# EasyEDA Pro project Motor_Sense_2025-12-15_V1.epro, schematic Schematic

## Sheets
1 core: Board Name: ESP_Motor_Talk; Create Date: 2025-12-16; Page Name: core; Project Name: ProDoc_LCSC ESP32S3R8N8 Dev Board V1.0.0_2025-12-15; Schematic Name: Schematic; Update Date: 2025-12-16; Company: 嘉立创EDA; Page Size: A4; Reviewed: 嘉立创EDA
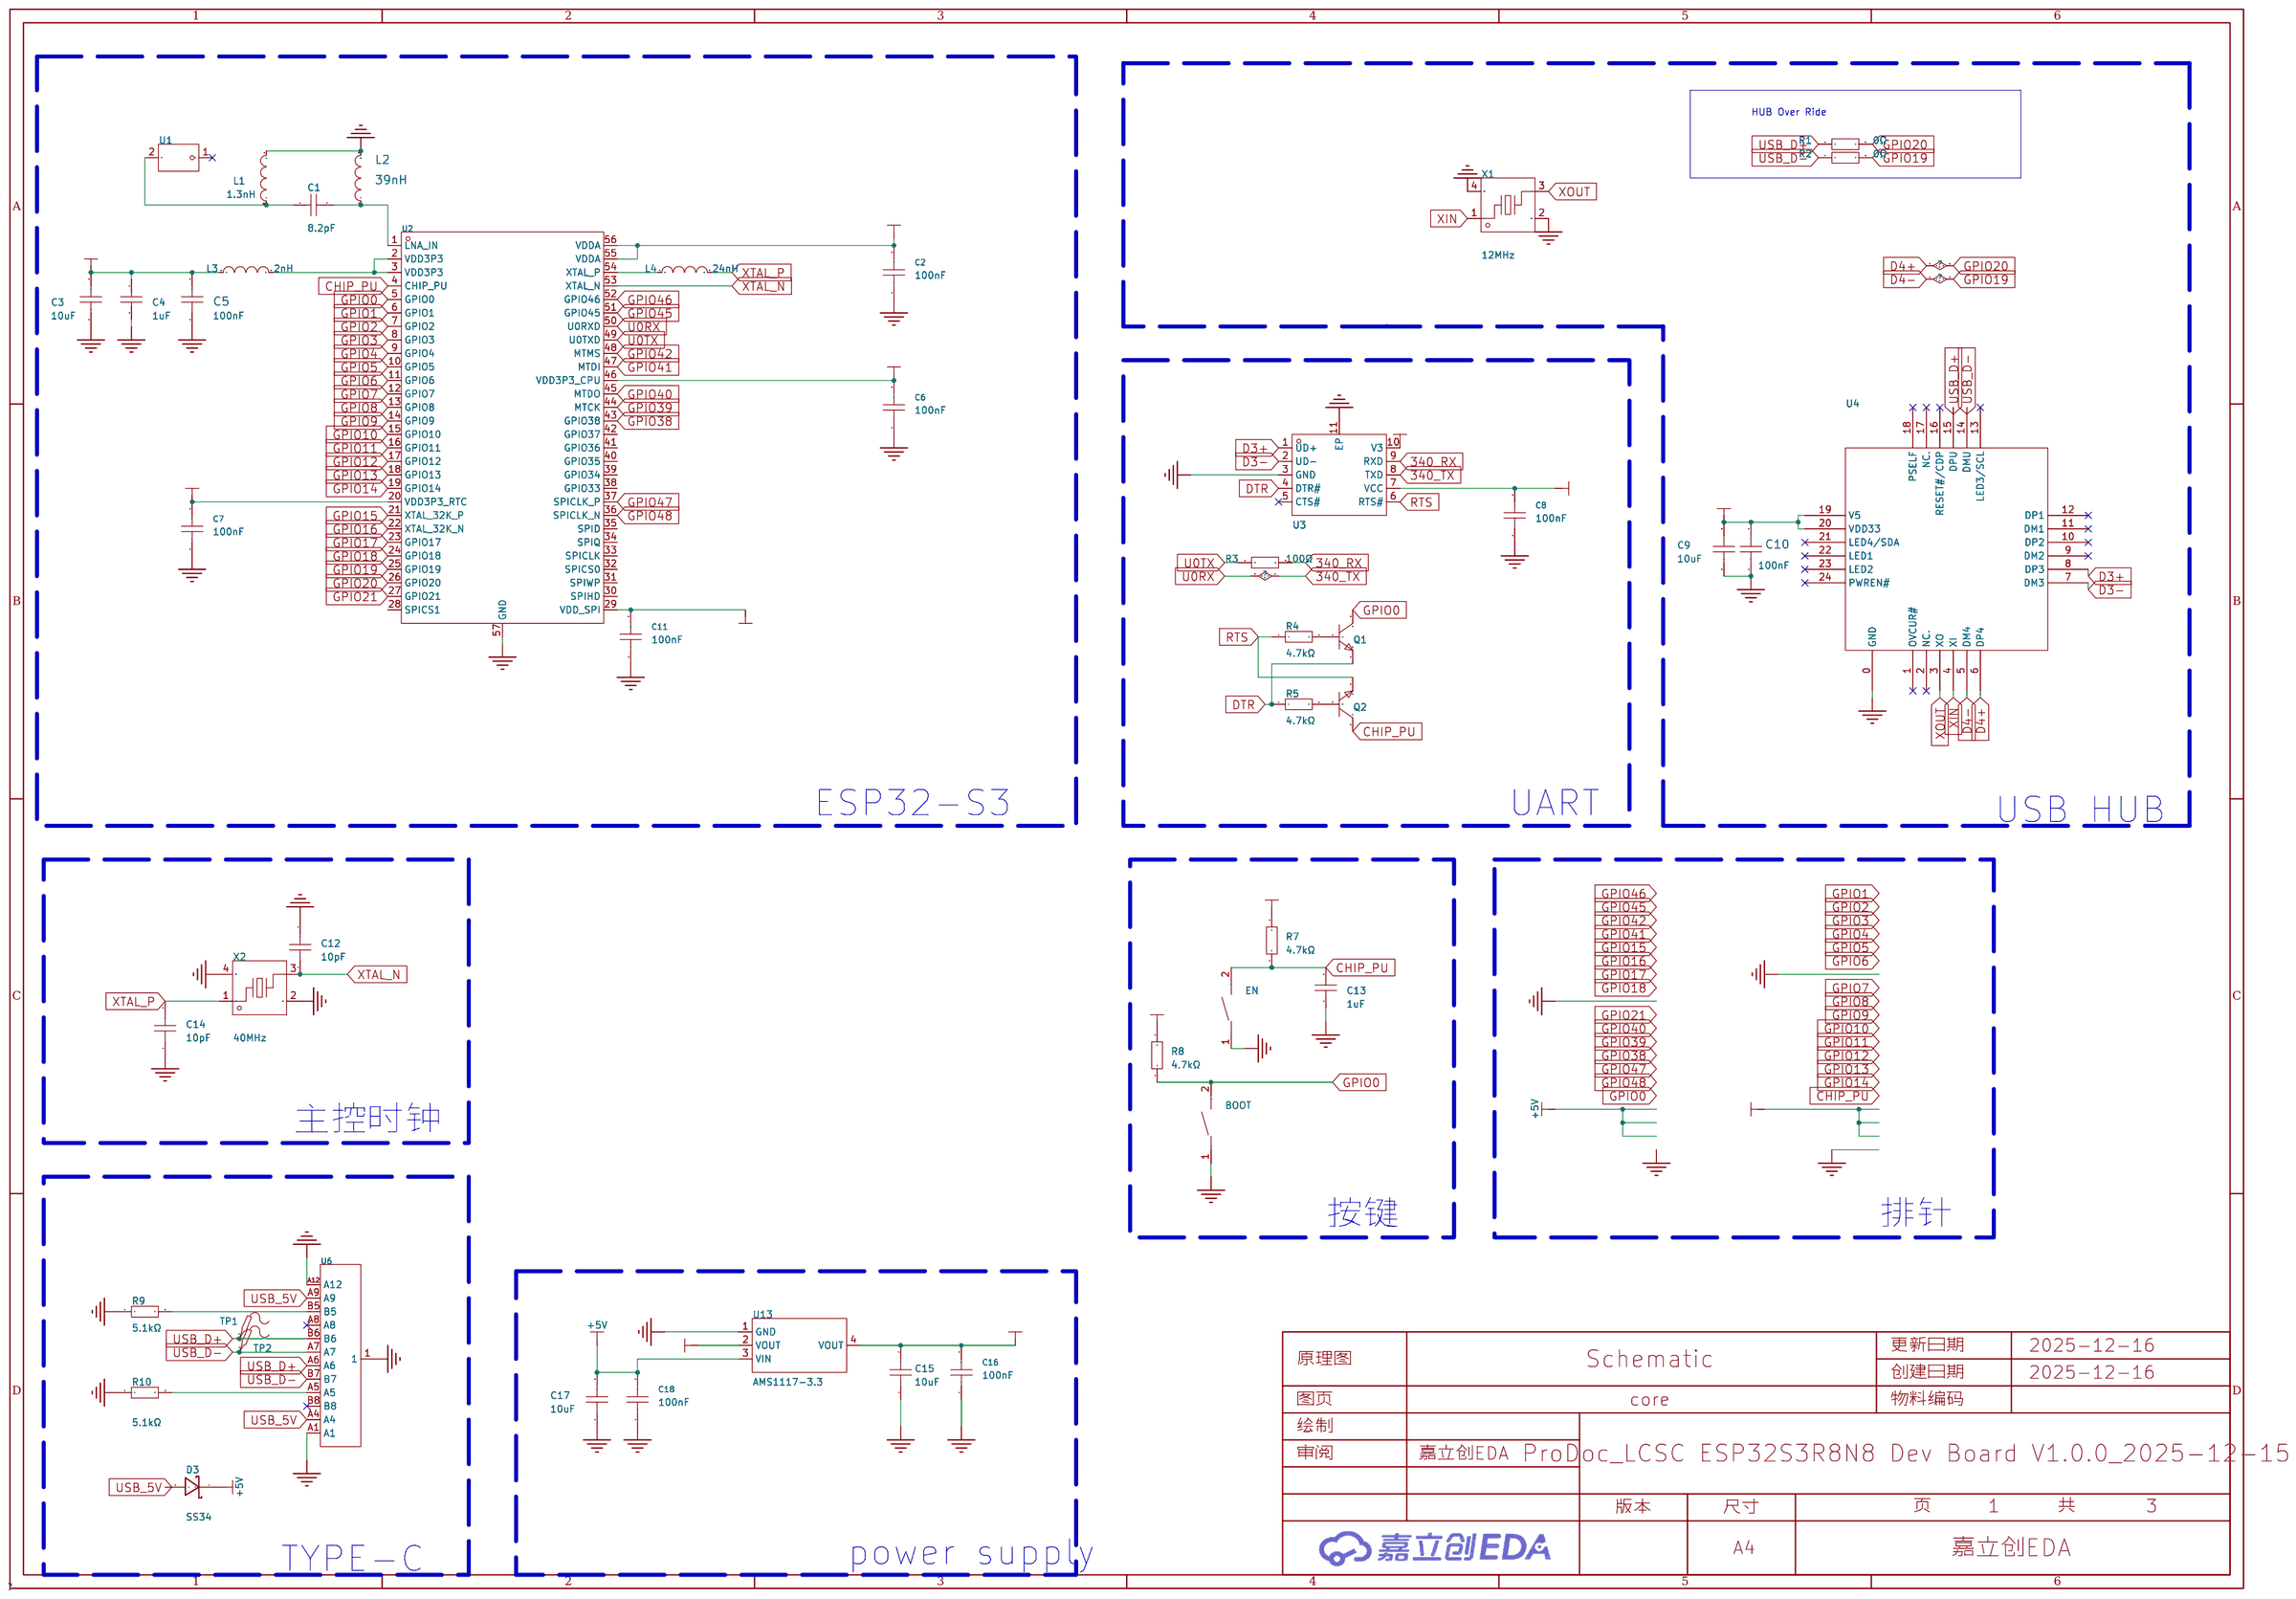
[diagram p0: core]
2 Power Supply: Page Name: Power Supply; Add into BOM: yes; Company: Your Company; Convert to PCB: yes; Date: 2025-09-11; Draw By: choosedews; REV: 1.0; Sheet: 1/1; spicePre: .
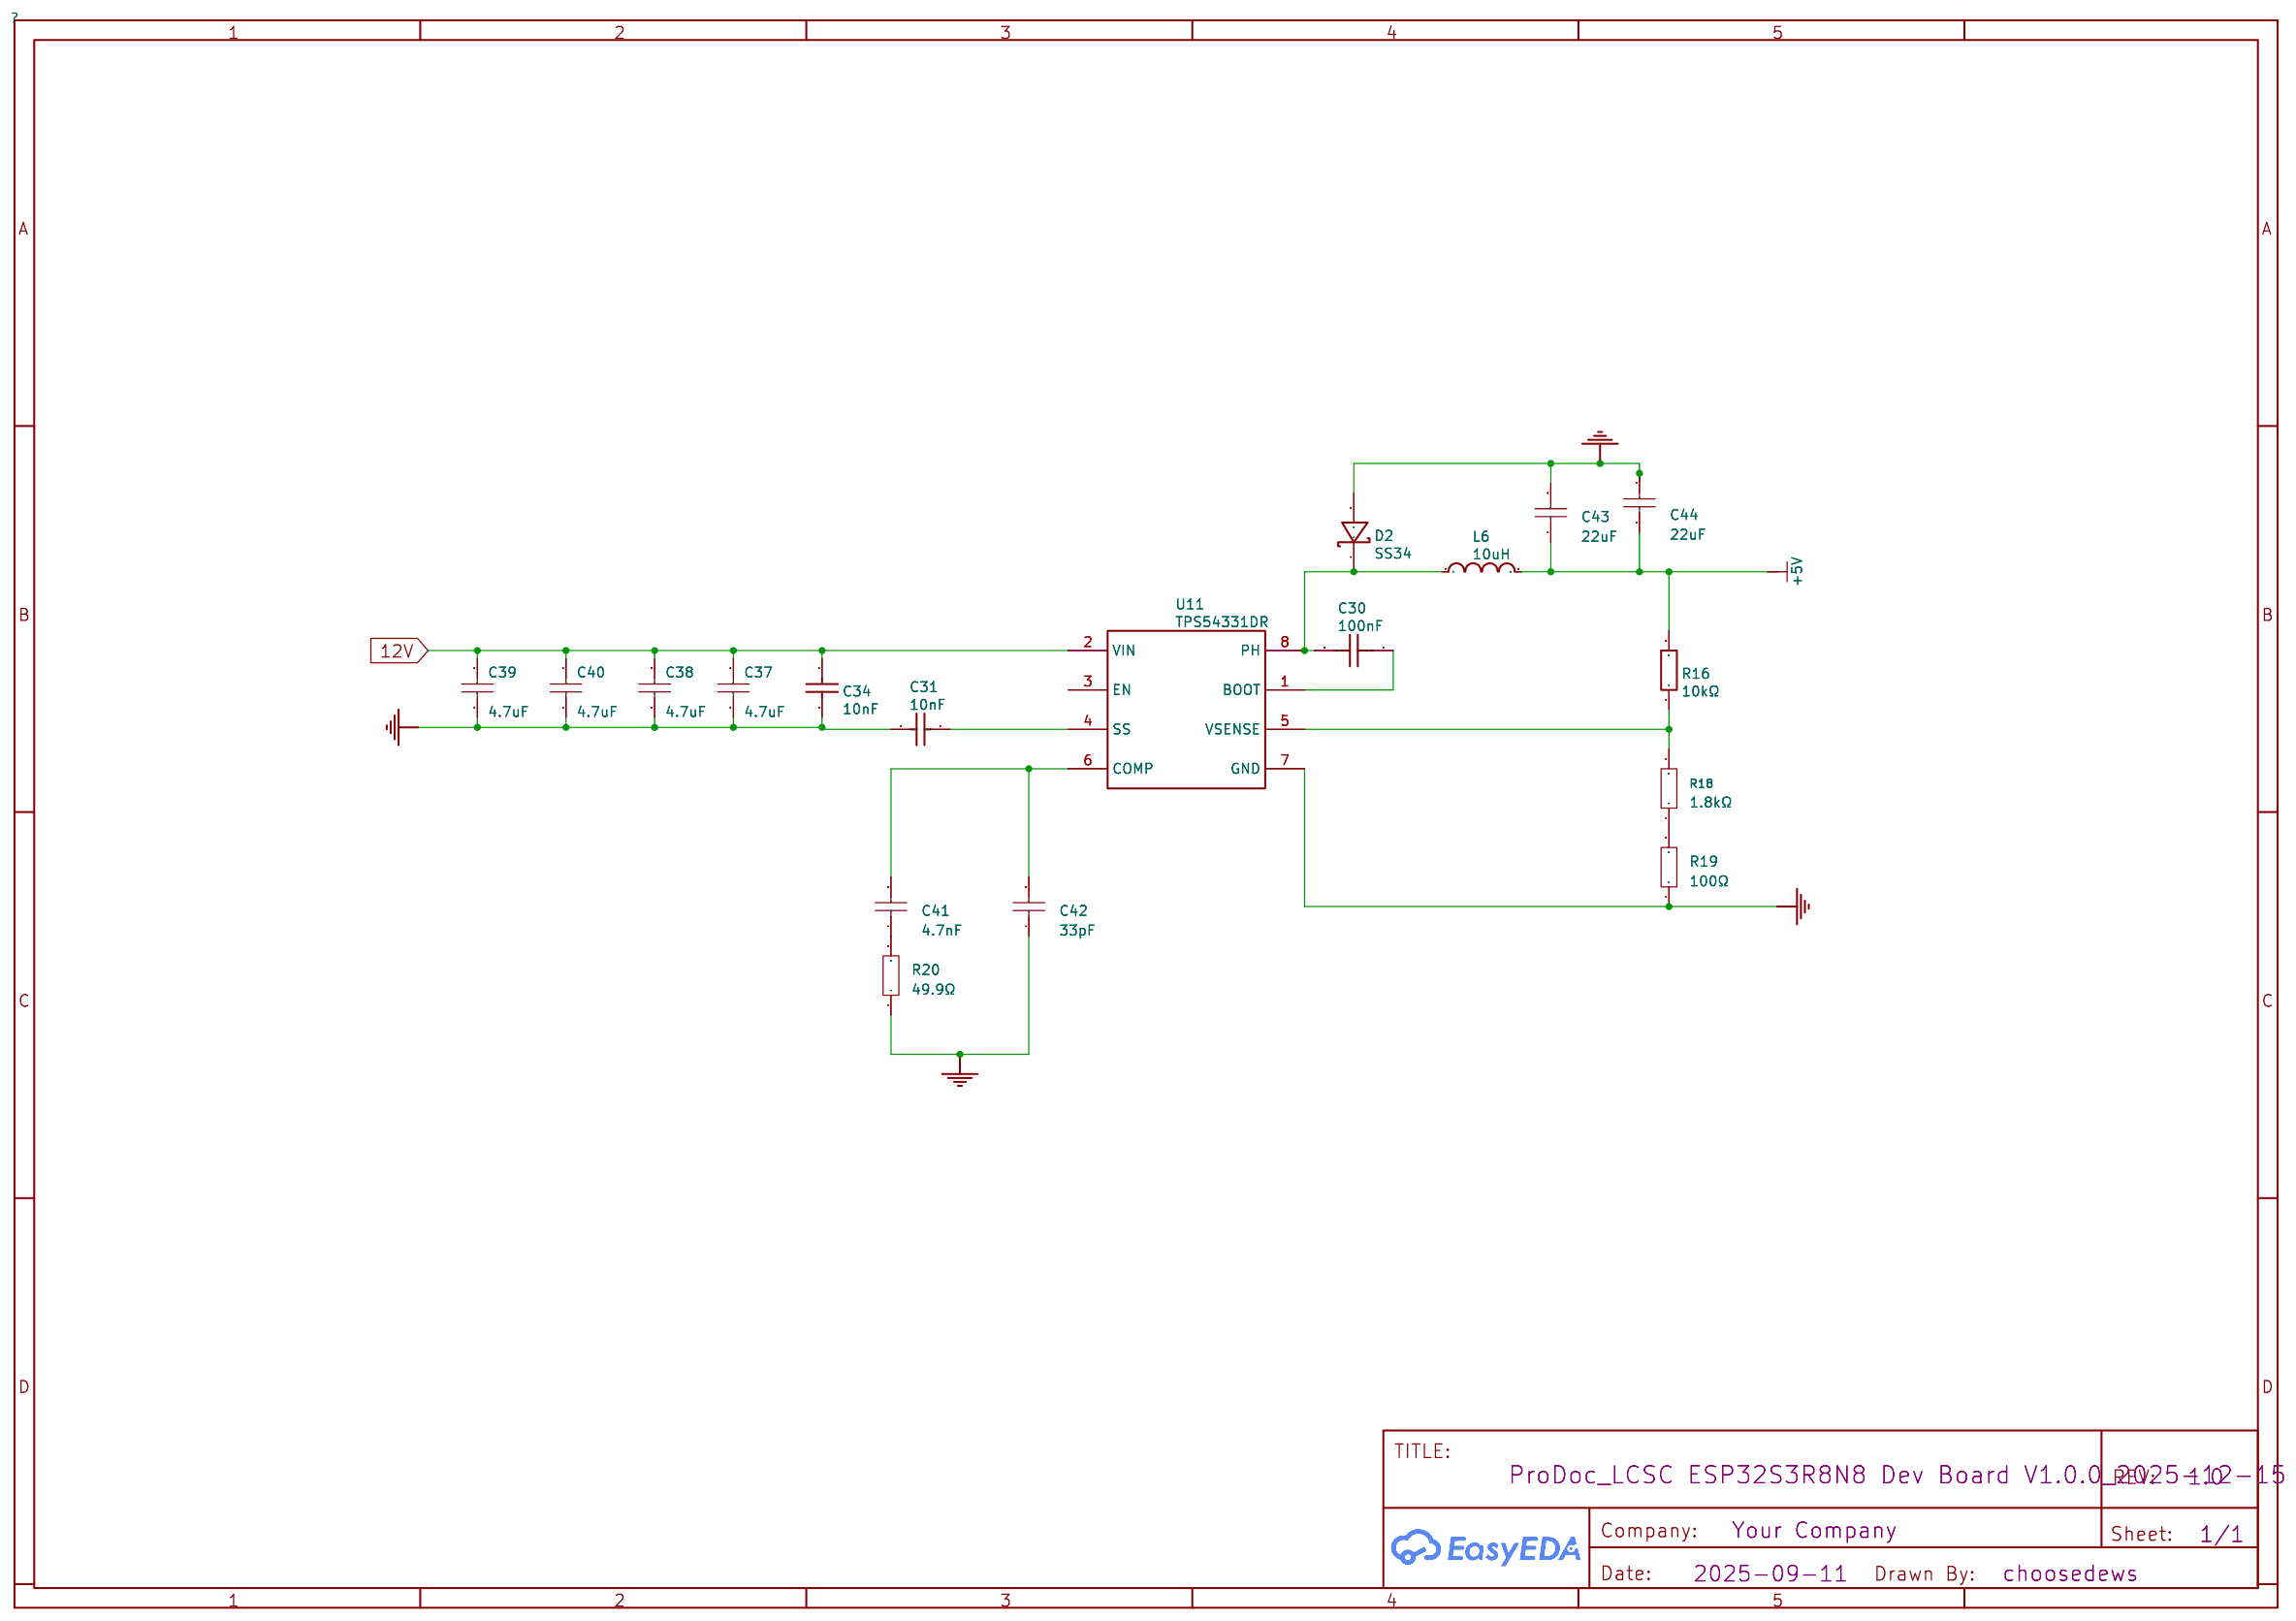
[diagram p1: Power Supply]
3 Motor Power Level: Page Name: Motor Power Level; Update Date: 2025-12-24; Company: EasyEDA.com; Version: V1.0
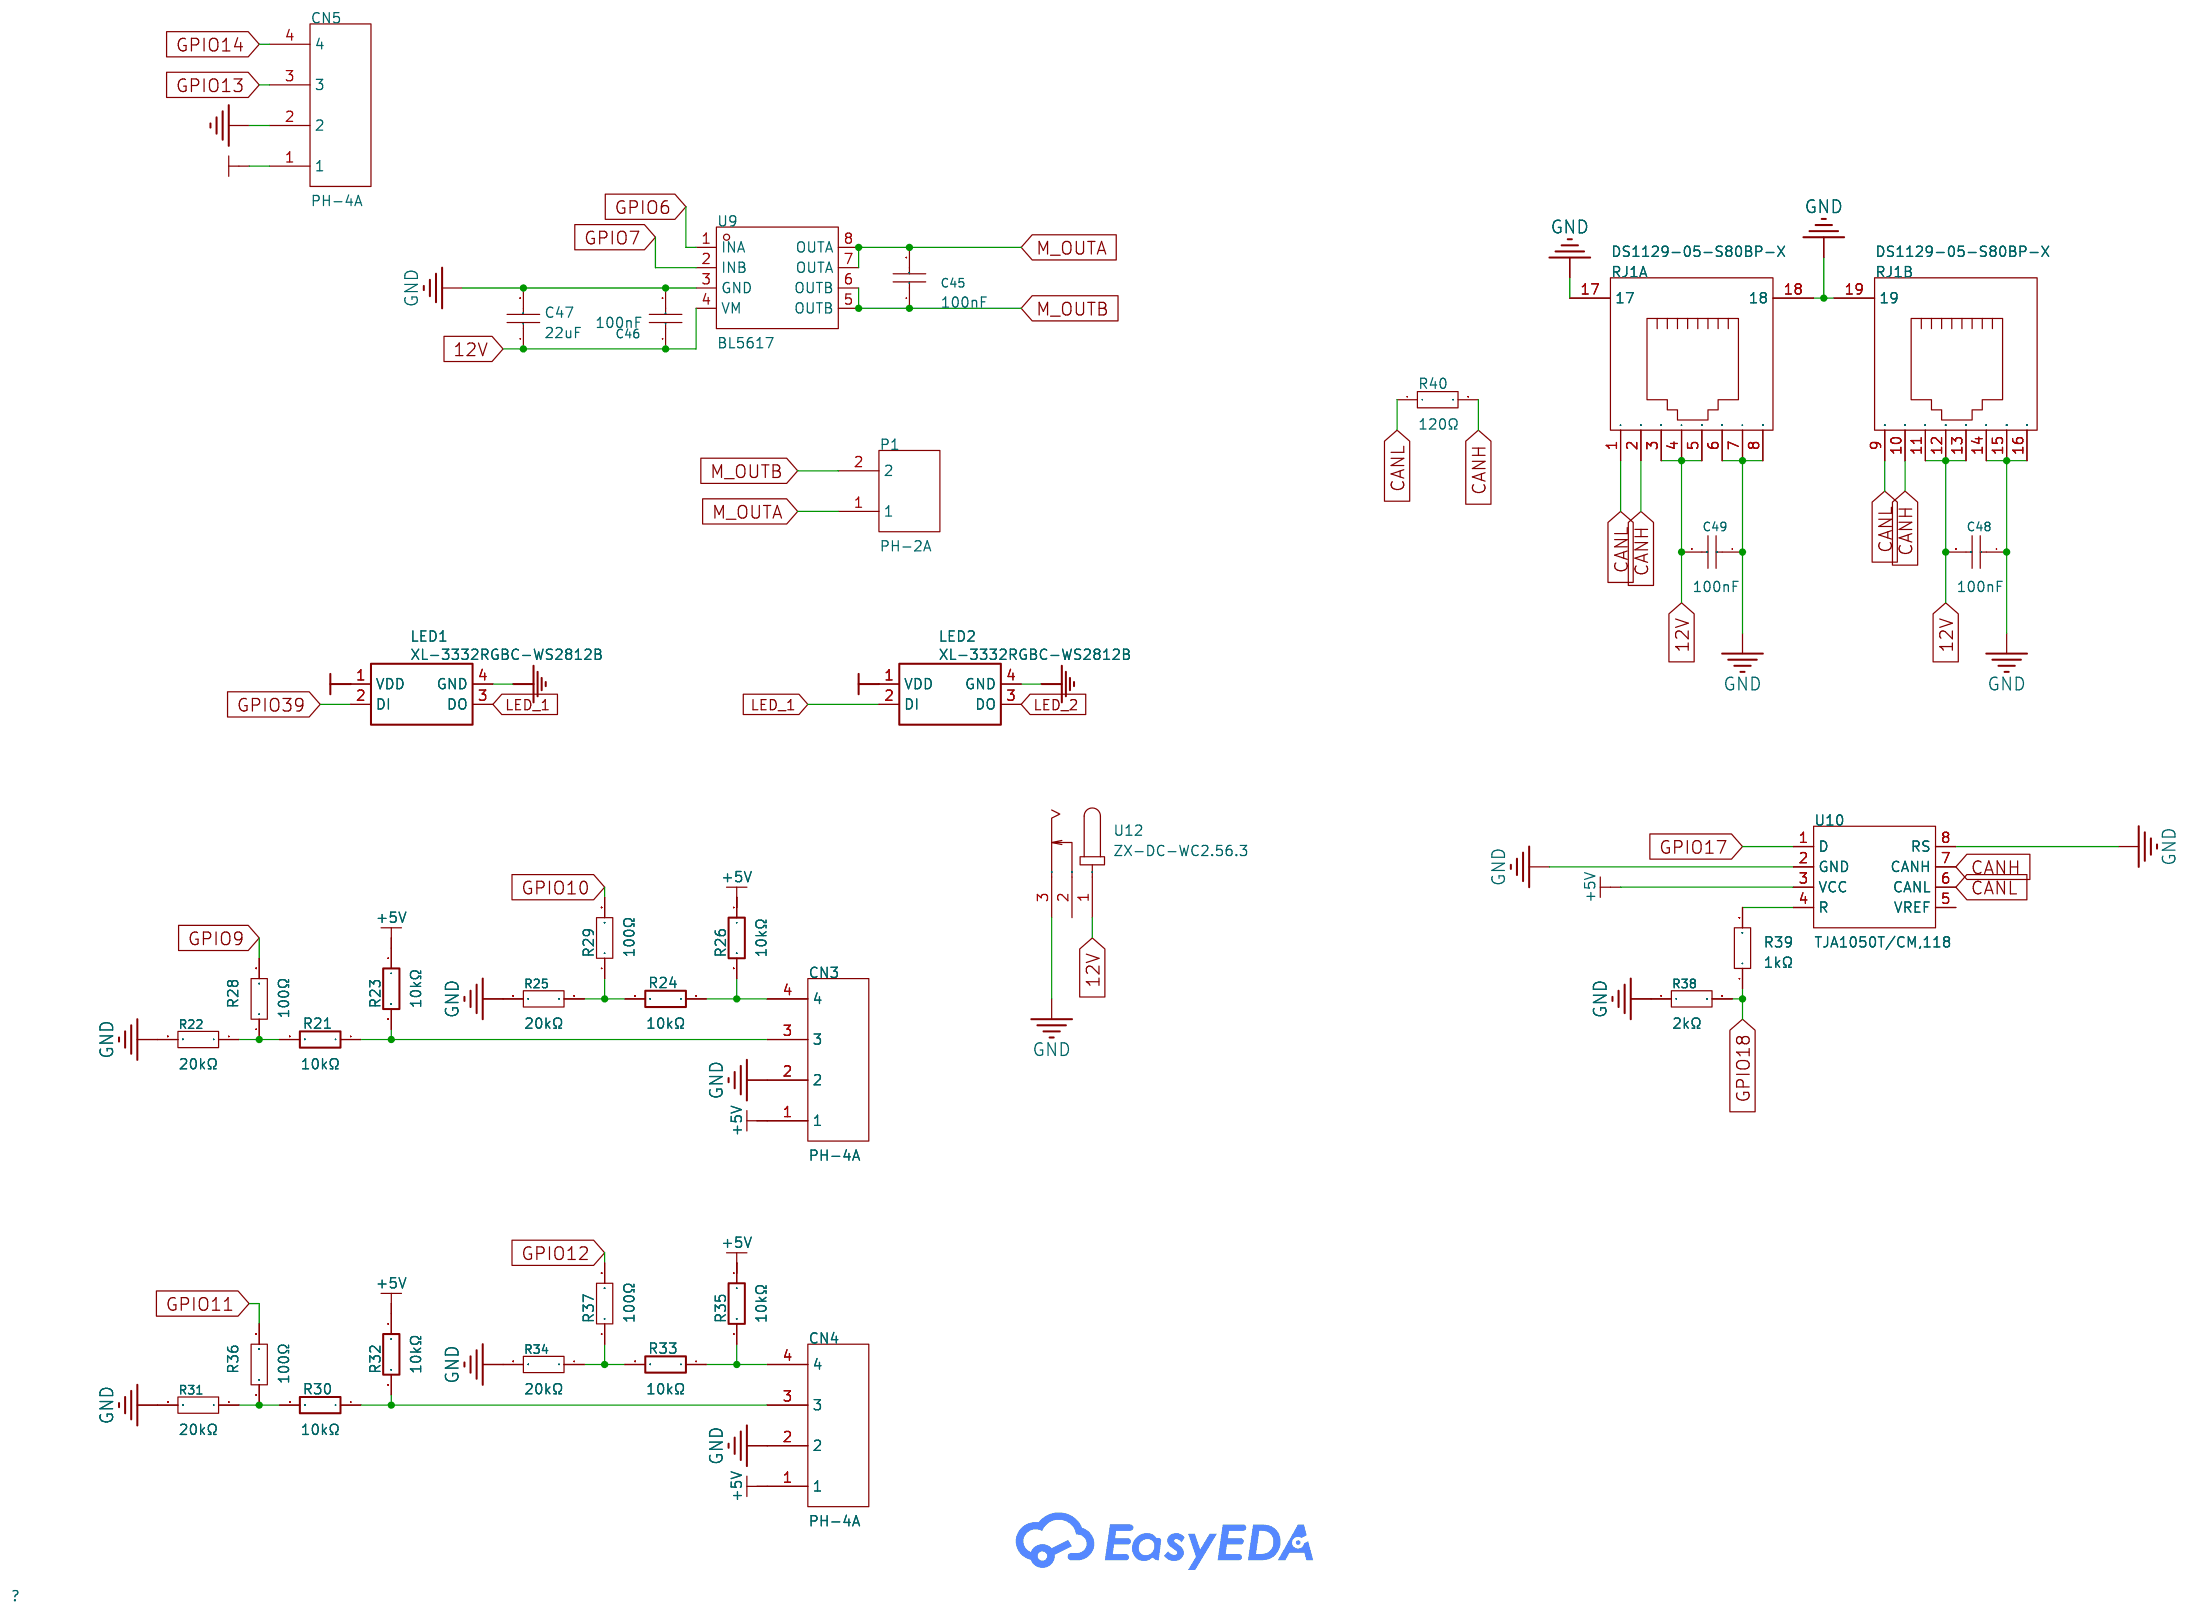
[diagram p2: Motor Power Level]

## Parts
sheet core
BOOT  TS-1088-AR02016  [SW-SMD_L3.9-W3.0-P4.45]
C1  8.2pF  [R0402]
C2  100nF  [C0402]
C3  10uF  [C0402]
C4  1uF  [C0402]
C5  100nF  [C0402]
C6  100nF  [C0402]
C7  100nF  [C0402]
C8  100nF  [C0402]
C9  10uF  [C0402]
C10  100nF  [C0402]
C11  100nF  [C0402]
C12  10pF  [R0402]
C13  1uF  [C0402]
C14  10pF  [R0402]
C15  10uF  [C0402]
C16  100nF  [C0402]
C17  10uF  [C0402]
C18  100nF  [C0402]
D3  SS34  [SMA_L4.3-W2.6-LS5.2-RD]
EN  TS-1088-AR02016  [SW-SMD_L3.9-W3.0-P4.45]
L1  1.3nH  [R0402]
L2  39nH  [R0402]
L3  2nH  [R0402]
L4  24nH  [R0402]
Q1  MMBT3904(RANGE:100-300)  [SOT-23-3_L2.9-W1.3-P1.90-LS2.4-BR]
Q2  MMBT3904(RANGE:100-300)  [SOT-23-3_L2.9-W1.3-P1.90-LS2.4-BR]
R1  0Ω  [R0402]  (no BOM)
R2  0Ω  [R0402]  (no BOM)
R3  100Ω  [R0402]
R4  4.7kΩ  [R0402]
R5  4.7kΩ  [R0402]
R7  4.7kΩ  [R0402]
R8  4.7kΩ  [R0402]
R9  5.1kΩ  [R0402]
R10  5.1kΩ  [R0402]
TP1  -  [Test-Point-0.5mm]
TP2  -  [Test-Point-0.5mm]
U1  RFANT5220110A0T  [FILTER-SMD_L5.2-W2.0-L]
U2  ESP32-S3FN8  [QFN-56_L7.0-W7.0-P0.40-TL-EP4.0]
U3  CH340K  [ESOP-10_L4.9-W3.9-P1.00-LS6.2-BL-EP]
U4  CH334F  [QFN24_4X4]
U6  USB-TYPE-C-019  [TYPE-C-SMD_HX-TYPE-C-16PIN]
U13  AMS1117-3.3  [SOT-223-3_L6.5-W3.4-P2.30-LS7.0-BR]
X1  12MHz  [CRYSTAL-SMD_4P-L2.5-W2.0-BL-A]
X2  40MHz  [CRYSTAL-SMD_4P-L2.5-W2.0-BL]
sheet Motor Power Level
C45  100nF  [C1206]
C46  100nF  [C1206]
C47  22uF  [C1206]
C48  100nF  [C1206]
C49  100nF  [C1206]
CN3  PH-4A  [CONN-TH_PH-4A]
CN4  PH-4A  [CONN-TH_PH-4A]
CN5  PH-4A  [CONN-TH_PH-4A]
LED1  XL-3332RGBC-WS2812B  [LED-SMD_4P-L3.3-W3.2_XL-3332RGBC-WS2812B]
LED2  XL-3332RGBC-WS2812B  [LED-SMD_4P-L3.3-W3.2_XL-3332RGBC-WS2812B]
P1  PH-2A  [CONN-TH_2P-P2.00_PH-2A_C2319]
R21  10kΩ  [R0402]
R22  20kΩ  [R0402]
R23  10kΩ  [R0402]
R24  10kΩ  [R0402]
R25  20kΩ  [R0402]
R26  10kΩ  [R0402]
R28  100Ω  [R0402]
R29  100Ω  [R0402]
R30  10kΩ  [R0402]
R31  20kΩ  [R0402]
R32  10kΩ  [R0402]
R33  10kΩ  [R0402]
R34  20kΩ  [R0402]
R35  10kΩ  [R0402]
R36  100Ω  [R0402]
R37  100Ω  [R0402]
R38  2kΩ  [R0402]
R39  1kΩ  [R0402]
R40  120Ω  [R0402]
RJ1  DS1129-05-S80BP-X  [RJ45-TH_DS1129-05-S80BP-X]  (sections 1,2)
U9  BL5617  [SOP-8_L4.9-W3.9-P1.27-LS6.0-BL]
U10  TJA1050T/CM,118  [SOIC-8_L5.0-W4.0-P1.27-LS6.0-BL]
U12  ZX-DC-WC2.56.3  [DC-TH_ZX-DC-WC2.56.3]
sheet Power Supply
C30  100nF  [C0603]
C31  10nF  [C0603]
C34  10nF  [C0603]
C37  4.7uF  [C0805]
C38  4.7uF  [C0805]
C39  4.7uF  [C0805]
C40  4.7uF  [C0805]
C41  4.7nF  [C0603]
C42  33pF  [C0402]
C43  22uF  [C1206]
C44  22uF  [C1206]
D2  SS34  [SMA_L4.3-W2.6-LS5.2-RD]
L6  10uH  [L0603]
R16  10kΩ  [R0402]
R18  1.8kΩ  [R0603]
R19  100Ω  [R0402]
R20  49.9Ω  [R0603]
U11  TPS54331DR  [SOIC-8_L5.0-W4.0-P1.27-LS6.0-BL]

## Library data of the parts
BOOT EN = TS-1088-AR02016: Circuit:SPST Actuator Style:Round Button Operating Force:1.6N Mounting Type:Surface Mount,Vertical Length:4mm Width:3mm Switch Height:2mm with Bracket:Without Bracket Contact Current:50mA Voltage Rating:12V Actuator/Cap Color:Black Termination Style:SMD(S; LCSC Part Name: 4*3*2mm 立贴 轻触开关; Supplier Part: C720477; Manufacturer: XUNPU(讯普); Supplier Footprint: SMD,4x3mm; JLCPCB Part Class: Basic Part; Datasheet: https://item.szlcsc.com/datasheet/TS-1088-AR02016/763484.html; Supplier: LCSC; Circuit: SPST; Actuator Style: Round Button; Operating Force: 1.6N; Mounting Type: Surface Mount,Vertical; Length: 4mm; Width: 3mm; Switch Height: 2mm; with Bracket: Without Bracket; Contact Current: 50mA; Voltage Rating: 12V; Actuator/Cap Color: Black; Termination Style: SMD(SMT) Tab; Life: 100,000 Cycles; Operating Temperature: -30℃~+80℃
C1 = 0402CG8R2C500NT: 容值:8.2pF;额定电压:50V;材质(温度系数):C0G;; LCSC Part Name: 8.2pF 50V ±0.25pF; Supplier Part: C1579; Manufacturer: FH(风华); Supplier Footprint: 0402; JLCPCB Part Class: 扩展库; Datasheet: https://atta.szlcsc.com/upload/public/pdf/source/20200305/C486355_26A10D38EF8C2A5C37091D0039909270.pdf; Supplier: LCSC; Voltage Rated: 50V; Temperature Coefficient: C0G
C2 C5-C8 C10 C11 C16 C18 = CL05B104KO5NNNC: Capacitance:100nF Tolerance:±10% Tolerance:±10% Voltage Rating:16V Temperature Coefficient:X7R; LCSC Part Name: 100nF ±10% 16V; Supplier Part: C1525; Manufacturer: SAMSUNG(三星); Supplier Footprint: 0402; JLCPCB Part Class: Basic Part; Datasheet: https://item.szlcsc.com/datasheet/CL05B104KO5NNNC/1877.html; Supplier: LCSC; Tolerance: ±10%; Voltage Rating: 16V; Temperature Coefficient: X7R
C3 C9 C15 C17 = CL05A106MQ5NUNC: Capacitance:10uF Tolerance:±20% Tolerance:±20% Voltage Rating:6.3V Temperature Coefficient:X5R; LCSC Part Name: 10uF ±20% 6.3V; Supplier Part: C15525; Manufacturer: SAMSUNG(三星); Supplier Footprint: 0402; JLCPCB Part Class: Basic Part; Datasheet: https://item.szlcsc.com/datasheet/CL05A106MQ5NUNC/16204.html; Supplier: LCSC; Tolerance: ±20%; Voltage Rating: 6.3V; Temperature Coefficient: X5R
C4 C13 = CL05A105KA5NQNC: Capacitance:1uF Tolerance:±10% Tolerance:±10% Voltage Rating:25V Temperature Coefficient:X5R; LCSC Part Name: 1uF ±10% 25V; Supplier Part: C52923; Manufacturer: SAMSUNG(三星); Supplier Footprint: 0402; JLCPCB Part Class: Basic Part; Datasheet: https://item.szlcsc.com/datasheet/CL05A105KA5NQNC/53938.html; Supplier: LCSC; Tolerance: ±10%; Voltage Rating: 25V; Temperature Coefficient: X5R
C12 C14 = CL05C100JB5NNNC: 容值:10pF;精度:±5%;额定电压:50V;材质(温度系数):C0G;; LCSC Part Name: 10pF ±5% 50V; Supplier Part: C32949; Manufacturer: SAMSUNG(三星); Supplier Footprint: 0402; JLCPCB Part Class: Basic Part; Datasheet: https://atta.szlcsc.com/upload/public/pdf/source/20160103/1457707722238.pdf; Supplier: LCSC; Tolerance: ±5%; Voltage Rated: 50V; Temperature Coefficient: C0G
D2 D3 = SS34: Supplier: LCSC; Manufacturer: MDD(辰达半导体); Supplier Part: C8678; JLCPCB Part Class: Basic Part; spicePre: D; spiceSymbolName: SS34_C8678
L1 = SDCL1005C1N3STDF: 电感值:1.3nH;精度:-;额定电流:400mA;直流电阻(DCR):100mΩ;饱和电流(Isat):-;; Supplier Part: C279756; Manufacturer: Sunlord(顺络); Supplier Footprint: 0402; JLCPCB Part Class: 扩展库; Datasheet: https://atta.szlcsc.com/upload/public/pdf/source/20231027/6126A3AAC5912C34388756BE22DEE00C.pdf; Supplier: LCSC; Rated Current: 400mA; DC Resistance (DCR): 100mΩ; Q @ Freq: 8@100MHz; Frequency - Self Resonant: 10GHz
L2 = SDCL1005C39NJTDF: 电感值:39nH;额定电流:200mA;直流电阻(DCR):1Ω;精度:±5%;; Supplier Part: C26443; Manufacturer: Sunlord(顺络); Supplier Footprint: 0402; JLCPCB Part Class: 扩展库; Supplier: LCSC; Rated Current: 200mA; DC Resistance (DCR): 1Ω; Tolerance: ±5%
L3 = MLG1005S2N0BT000: 电感值:2nH;精度:-;额定电流:900mA;饱和电流(Isat):-;直流电阻(DCR):70mΩ;; LCSC Part Name: 2nH ±0.1nH; Supplier Part: C76769; Manufacturer: TDK; Supplier Footprint: 0402; JLCPCB Part Class: Extended Part; Datasheet: https://atta.szlcsc.com/upload/public/pdf/source/20160918/1474166917976.pdf; Supplier: LCSC; Rated Current: 900mA; DC Resistance (DCR): 70mΩ; Q @ Freq: 7@100MHz; Frequency - Self Resonant: 7.5GHz
L4 = SDCL1005C24NJTDF: 电感值:24nH;精度:±5%;额定电流:-;饱和电流(Isat):-;直流电阻(DCR):-;; LCSC Part Name: 24nH ±5%; Supplier Part: C74301; Manufacturer: Sunlord(顺络); Supplier Footprint: 0402; JLCPCB Part Class: 扩展库; Datasheet: https://atta.szlcsc.com/upload/public/pdf/source/20210916/2389196E6DC4CA1121B2D3610B126F46.pdf; Supplier: LCSC; Tolerance: ±5%
Q1 Q2 = MMBT3904(RANGE:100-300): type:NPN Current - Collector(Ic):200mA Collector - Emitter Voltage VCEO:40V Pd - Power Dissipation:200mW DC Current Gain:100@10mA,1V DC Current Gain:100@10mA,1V Transition frequency(fT):300MHz Current - Collector Cutoff:100nA Vce Saturation(VCE(sat)):300m; LCSC Part Name: hfe=100~300 NPN 电流:200mA 电压:40V; Supplier Part: C20526; Manufacturer: CJ(江苏长电/长晶); Supplier Footprint: SOT-23; JLCPCB Part Class: Basic Part; Datasheet: https://item.szlcsc.com/datasheet/MMBT3904(RANGE%253A100-300)/21237.html; Supplier: LCSC; type: NPN; Current - Collector(Ic): 200mA; Collector - Emitter Voltage VCEO: 40V; Pd - Power Dissipation: 200mW; DC Current Gain: 100@10mA,1V; Transition frequency(fT): 300MHz; Current - Collector Cutoff: 100nA; Vce Saturation(VCE(sat)): 300mV@50mA,5mA; Operating Temperature: -55℃~+150℃; Emitter-Base Voltage(Vebo): 6V; Number: 1 NPN
R1 R2 = 0402WGF0000TCE: 电阻类型:厚膜电阻;阻值:0Ω;精度:±1%;功率:62.5mW;; LCSC Part Name: 0Ω ±1% 62.5mW; Supplier Part: C17168; Manufacturer: UNI-ROYAL(厚声); Supplier Footprint: 0402; JLCPCB Part Class: 基础库; Datasheet: https://atta.szlcsc.com/upload/public/pdf/source/20200306/C422600_1E6D84923E4A46A82E41ADD87F860B5C.pdf; Supplier: LCSC; Type: 厚膜电阻; Tolerance: ±1%; Power(Watts): 62.5mW; Temperature Coefficient: ±800ppm/℃; Overload Voltage (Max): 50V; Operating Temperature Range: -55℃~+155℃
R3 R19 R28 R29 R36 R37 = 0402WGF1000TCE: Type:Thick Film Resistors Resistance: Tolerance:±1% Tolerance:±1% Power(Watts): Overload Voltage (Max): Temperature Coefficient:±200ppm/℃ Temperature Coefficient:±200ppm/℃ Operating Temperature Range:-55℃~+155℃ Operating Temperature Range:-55℃~+155℃; LCSC Part Name: 100Ω ±1% 62.5mW 厚膜电阻; Supplier Part: C25076; Manufacturer: UNI-ROYAL(厚声); Supplier Footprint: 0402; JLCPCB Part Class: Basic Part; Datasheet: https://atta.szlcsc.com/upload/public/pdf/source/20200306/C422600_1E6D84923E4A46A82E41ADD87F860B5C.pdf; Supplier: LCSC; Type: Thick Film Resistors; Tolerance: ±1%; Temperature Coefficient: ±200ppm/℃; Operating Temperature Range: -55℃~+155℃
R4 R5 R7 R8 = 0402WGF4701TCE: Type:Thick Film Resistor Resistance:4.7kΩ Tolerance:±1% Tolerance:±1% Power(Watts):62.5mW Voltage-Supply(Max):50V Temperature Coefficient:±100ppm/℃ Temperature Coefficient:±100ppm/℃ Operating Temperature:-55℃~+155℃ Operating Temperature:-55℃~+155℃; LCSC Part Name: 4.7kΩ ±1% 62.5mW 厚膜电阻; Supplier Part: C25900; Manufacturer: UNI-ROYAL(厚声); Supplier Footprint: 0402; JLCPCB Part Class: Basic Part; Datasheet: https://item.szlcsc.com/datasheet/0402WGF4701TCE/26643.html; Supplier: LCSC; Type: Thick Film Resistor; Tolerance: ±1%; Power(Watts): 62.5mW; Voltage-Supply(Max): 50V; Temperature Coefficient: ±100ppm/℃; Operating Temperature: -55℃~+155℃
R9 R10 = 0402WGF5101TCE: 电阻类型:厚膜电阻;阻值:5.1kΩ;精度:±1%;功率:62.5mW;; LCSC Part Name: 5.1kΩ ±1% 62.5mW; Supplier Part: C25905; Manufacturer: UNI-ROYAL(厚声); Supplier Footprint: 0402; JLCPCB Part Class: 基础库; Datasheet: https://atta.szlcsc.com/upload/public/pdf/source/20200306/C422600_1E6D84923E4A46A82E41ADD87F860B5C.pdf; Supplier: LCSC; Type: 厚膜电阻; Tolerance: ±1%; Power(Watts): 62.5mW; Temperature Coefficient: ±100ppm/℃; Overload Voltage (Max): 50V; Operating Temperature Range: -55℃~+155℃
TP1 TP2 = Test-Point: Test Point 测试点
U1 = RFANT5220110A0T: 2.4 GHz 陶瓷天线; Supplier Part: C127611; Manufacturer: Walsin(华新科); Supplier Footprint: SMD,2x5.2mm; JLCPCB Part Class: 扩展库; Datasheet: https://atta.szlcsc.com/upload/public/pdf/source/20180326/C127611_CAA3DCCF3A021118096CAD99FC50242A.pdf; Supplier: LCSC
U2 = ESP32-S3FN8: Supplier Part: C2913196; Manufacturer: ESPRESSIF(乐鑫); Supplier Footprint: QFN-56-EP(7x7); JLCPCB Part Class: Extended Part; Datasheet: https://item.szlcsc.com/datasheet/ESP32-S3FN8/3198294.html; Supplier: LCSC
U3 = CH340K: 应用功能:-;接口协议:-;; LCSC Part Name: CH340K USB转串口芯片 CH340; Supplier Part: C968586; Manufacturer: WCH(南京沁恒); Supplier Footprint: ESOP-10-EP-150mil; JLCPCB Part Class: 扩展库; Datasheet: https://atta.szlcsc.com/upload/public/pdf/source/20200819/C84681_ADBED554CE321879DBD6B1D06488689C.pdf; Supplier: LCSC
U4 = CH334F
U6 = USB-TYPE-C-019: Supplier Part: C2927039; Manufacturer: DEALON(德艺隆); Supplier Footprint: 插件; JLCPCB Part Class: 扩展库; Supplier: LCSC
U13 = AMS1117-3.3_C6186: Output Type:Fixed Voltage - Supply:16V Output Voltage:3.3V Output Voltage:3.3V Output Current:1A Power Supply Rejection Ratio (PSRR):72dB@(120Hz) Voltage Dropout:1.1V@(800mA) standby current:5mA Noise:0.003%Vout Features:Over Current Protection；Over Tempe; LCSC Part Name: 输出3.3V 1A; Supplier Part: C6186; Manufacturer: AMS; Supplier Footprint: SOT-223; JLCPCB Part Class: Basic Part; Datasheet: https://item.szlcsc.com/datasheet/AMS1117-3.3/6652.html; Supplier: LCSC; Output Type: Fixed; Voltage - Supply: 16V; Output Voltage: 3.3V; Output Current: 1A; Power Supply Rejection Ratio (PSRR): 72dB@(120Hz); Voltage Dropout: 1.1V@(800mA); standby current: 5mA; Noise: 0.003%Vout; Features: Over Current Protection；Over Temperature Protection; Operating Temperature: -40℃~+125℃; Output Configuration: Positive; Number of Outputs: 1
X1 = X252012MMB4SI-24: 频率:12MHz;频率公差:±10ppm;负载电容:10pF;; LCSC Part Name: 12MHz ±10ppm 10pF YSX221SL; Supplier Part: C2896601; Manufacturer: YXC(扬兴晶振); Supplier Footprint: SMD2520-4P; JLCPCB Part Class: 扩展库; Datasheet: https://atta.szlcsc.com/upload/public/pdf/source/20210917/7E0AFFDD74AE514FE25E1ADDD9E3C073.pdf; Supplier: LCSC; Crystal Type: 贴片无源晶振; Frequency Tolerance: ±10ppm; Frequency Stability: ±20ppm; Load Capacitance: 10pF; Operating Temperature: -40℃~+85℃
X2 = S2240000101050JY: 频率:40MHz;频率公差:±10ppm;负载电容:10pF;; LCSC Part Name: 40MHz ±10ppm 内置负载电容:10pF; Supplier Part: C2885592; Manufacturer: JGHC(晶光华); Supplier Footprint: SMD2520-4P; JLCPCB Part Class: 扩展库; Datasheet: https://atta.szlcsc.com/upload/public/pdf/source/20191012/C426971_E72B01839CFBB8D8B48FED2AC1315BE2.pdf; Supplier: LCSC; Crystal Type: 贴片无源晶振; Frequency Tolerance: ±10ppm; Load Capacitance: 10pF; Equivalent Series Resistance (ESR): 50Ω; Operating Temperature: -40℃~+85℃
C45 C46 C48 C49 = CL31B104KBCNNNC: Capacitance:100nF Tolerance:±10% Tolerance:±10% Voltage Rating:50V Temperature Coefficient:X7R; LCSC Part Name: 100nF ±10% 50V; Supplier Part: C24497; Manufacturer: SAMSUNG(三星); Supplier Footprint: 1206; JLCPCB Part Class: Basic Part; Datasheet: https://item.szlcsc.com/datasheet/CL31B104KBCNNNC/25237.html; Supplier: LCSC; Tolerance: ±10%; Voltage Rating: 50V; Temperature Coefficient: X7R
C43 C44 C47 = CL31A226KAHNNNE: Capacitance:22uF Tolerance:±10% Tolerance:±10% Voltage Rating:25V Temperature Coefficient:X5R; LCSC Part Name: 22uF ±10% 25V; Supplier Part: C12891; Manufacturer: SAMSUNG(三星); Supplier Footprint: 1206; JLCPCB Part Class: Basic Part; Datasheet: https://item.szlcsc.com/datasheet/CL31A226KAHNNNE/13537.html; Supplier: LCSC; Tolerance: ±10%; Voltage Rating: 25V; Temperature Coefficient: X5R
CN3-CN5 = PH-4A_C2321: Pins Structure:1x4P Pitch:2mm Mounting Type:Through Hole Reference Series:PH Number of Pins:4P Number of Rows:1 Number of PINs Per Row:4 Row Spacing:- Current Rating:5A Contact Material:Brass Contact Plating:Tin Operating Temperature:-25℃~+85℃ Operating T; LCSC Part Name: 1x4P 间距:2mm 直插 系列:PH; Supplier Part: C2321; Manufacturer: BOOMELE(博穆精密); Supplier Footprint: 插件,P=2mm; JLCPCB Part Class: Extended Part; Datasheet: https://item.szlcsc.com/datasheet/PH-4A/2695.html; Supplier: LCSC; Pins Structure: 1x4P; Pitch: 2mm; Mounting Type: Through Hole; Reference Series: PH; Number of Pins: 4P; Number of Rows: 1; Number of PINs Per Row: 4; Current Rating: 5A; Contact Material: Brass; Contact Plating: Tin; Operating Temperature: -25℃~+85℃; Voltage Rating: 250V; Plastic Material: PA66; Flame Retardant Rating: UL94V-0; Color: Beige
LED1 LED2 = XL-3332RGBC-WS2812B: Supplier: LCSC; Supplier Part: C42400839; Manufacturer: XINGLIGHT(成兴光); JLCPCB Part Class: Extended Part; Contributor: lcsc; spicePre: U
P1 = PH-2A_C2319: Pins Structure:1x2P Pitch:2mm Mounting Type:Through Hole Reference Series:PH Number of Pins:2P Number of Rows:1 Number of PINs Per Row:2 Row Spacing:- Current Rating:2A Contact Material:Brass Contact Plating:Tin Operating Temperature:-25℃~+85℃ Operating T; LCSC Part Name: 1x2P 间距:2mm 直插 系列:PH; Supplier Part: C2319; Manufacturer: BOOMELE(博穆精密); Supplier Footprint: 插件,P=2mm; JLCPCB Part Class: Extended Part; Datasheet: https://item.szlcsc.com/datasheet/PH-2A/2693.html; Supplier: LCSC; Pins Structure: 1x2P; Pitch: 2mm; Mounting Type: Through Hole; Reference Series: PH; Number of Pins: 2P; Number of Rows: 1; Number of PINs Per Row: 2; Current Rating: 2A; Contact Material: Brass; Contact Plating: Tin; Operating Temperature: -25℃~+85℃; Voltage Rating: 100V; Plastic Material: PA66; Color: Transparent; Z-Height of the Board: 6.05mm; Y-Width of Bottom Edge on Board: 4.7mm
R16 R21 R23 R24 R26 R30 R32 R33 R35 = 0402WGF1002TCE: Type:Thick Film Resistor Resistance:10kΩ Tolerance:±1% Tolerance:±1% Power(Watts):62.5mW Voltage-Supply(Max):50V Temperature Coefficient:±100ppm/℃ Temperature Coefficient:±100ppm/℃ Operating Temperature:-55℃~+155℃ Operating Temperature:-55℃~+155℃; LCSC Part Name: 10kΩ ±1% 62.5mW 厚膜电阻; Supplier Part: C25744; Manufacturer: UNI-ROYAL(厚声); Supplier Footprint: 0402; JLCPCB Part Class: Basic Part; Datasheet: https://item.szlcsc.com/datasheet/0402WGF1002TCE/26487.html; Supplier: LCSC; Type: Thick Film Resistor; Tolerance: ±1%; Power(Watts): 62.5mW; Voltage-Supply(Max): 50V; Temperature Coefficient: ±100ppm/℃; Operating Temperature: -55℃~+155℃
R22 R25 R31 R34 = 0402WGF2002TCE: Type:Thick Film Resistors Resistance:20kΩ Tolerance:±1% Tolerance:±1% Power(Watts): Overload Voltage (Max): Temperature Coefficient:±100ppm/℃ Temperature Coefficient:±100ppm/℃ Operating Temperature Range:-55℃~+155℃ Operating Temperature Range:-55℃~+155℃; LCSC Part Name: 20kΩ ±1% 62.5mW 厚膜电阻; Supplier Part: C25765; Manufacturer: UNI-ROYAL(厚声); Supplier Footprint: 0402; JLCPCB Part Class: Basic Part; Datasheet: https://atta.szlcsc.com/upload/public/pdf/source/20200306/C422600_1E6D84923E4A46A82E41ADD87F860B5C.pdf; Supplier: LCSC; Type: Thick Film Resistors; Tolerance: ±1%; Temperature Coefficient: ±100ppm/℃; Operating Temperature Range: -55℃~+155℃
R38 = 0402WGF2001TCE: Type:Thick Film Resistors Resistance:2kΩ Tolerance:±1% Tolerance:±1% Power(Watts): Overload Voltage (Max): Temperature Coefficient:±100ppm/℃ Temperature Coefficient:±100ppm/℃ Operating Temperature Range:-55℃~+155℃ Operating Temperature Range:-55℃~+155℃; LCSC Part Name: 2kΩ ±1% 62.5mW 厚膜电阻; Supplier Part: C4109; Manufacturer: UNI-ROYAL(厚声); Supplier Footprint: 0402; JLCPCB Part Class: Basic Part; Datasheet: https://atta.szlcsc.com/upload/public/pdf/source/20200306/C422600_1E6D84923E4A46A82E41ADD87F860B5C.pdf; Supplier: LCSC; Type: Thick Film Resistors; Tolerance: ±1%; Temperature Coefficient: ±100ppm/℃; Operating Temperature Range: -55℃~+155℃
R39 = 0402WGF1001TCE: Type:Thick Film Resistor Resistance:1kΩ Tolerance:±1% Tolerance:±1% Power(Watts):62.5mW Voltage-Supply(Max):50V Temperature Coefficient:±100ppm/℃ Temperature Coefficient:±100ppm/℃ Operating Temperature:-55℃~+155℃ Operating Temperature:-55℃~+155℃; LCSC Part Name: 1kΩ ±1% 62.5mW 厚膜电阻; Supplier Part: C11702; Manufacturer: UNI-ROYAL(厚声); Supplier Footprint: 0402; JLCPCB Part Class: Basic Part; Datasheet: https://item.szlcsc.com/datasheet/0402WGF1001TCE/12256.html; Supplier: LCSC; Type: Thick Film Resistor; Tolerance: ±1%; Power(Watts): 62.5mW; Voltage-Supply(Max): 50V; Temperature Coefficient: ±100ppm/℃; Operating Temperature: -55℃~+155℃
R40 = 0402WGF1200TCE: Type:Thick Film Resistor Resistance:120Ω Tolerance:±1% Tolerance:±1% Power(Watts):62.5mW Voltage-Supply(Max):50V Temperature Coefficient:±100ppm/℃ Temperature Coefficient:±100ppm/℃ Operating Temperature:-55℃~+155℃ Operating Temperature:-55℃~+155℃; LCSC Part Name: 120Ω ±1% 62.5mW 厚膜电阻; Supplier Part: C25079; Manufacturer: UNI-ROYAL(厚声); Supplier Footprint: 0402; JLCPCB Part Class: Basic Part; Datasheet: https://item.szlcsc.com/datasheet/0402WGF1200TCE/25822.html; Supplier: LCSC; Type: Thick Film Resistor; Tolerance: ±1%; Power(Watts): 62.5mW; Voltage-Supply(Max): 50V; Temperature Coefficient: ±100ppm/℃; Operating Temperature: -55℃~+155℃
RJ1 = DS1129-05-S80BP-X: Connector Type:RJ45 Jack Number of Ports:2 LED:Non-LED Shielding:- Ratings:-; LCSC Part Name: 不带LED; Supplier Part: C86580; Manufacturer: CONNFLY; Supplier Footprint: 插件; JLCPCB Part Class: Extended Part; Datasheet: https://item.szlcsc.com/datasheet/DS1129-05-S80BP-X/87757.html; Supplier: LCSC; Connector Type: RJ45 Jack; Number of Ports: 2; LED: Non-LED
U9 = BL5617: Number of H-bridges:1 Output Current:3A Output Current:3A Peak Current:5A Voltage - Supply:- Voltage - Supply:- RDS(on):200mΩ Quiescent Current(Iq):10uA Operating Temperature:-40℃~+150℃ Operating Temperature:-40℃~+150℃; Supplier Part: C2841020; Manufacturer: BL(上海贝岭); Supplier Footprint: SOP-8; JLCPCB Part Class: Extended Part; Datasheet: https://item.szlcsc.com/datasheet/BL5617/3022297.html; Supplier: LCSC; Number of H-bridges: 1; Output Current: 3A; Peak Current: 5A; RDS(on): 200mΩ; Quiescent Current(Iq): 10uA; Operating Temperature: -40℃~+150℃
U10 = TJA1050T/CM,118: Type: Supply Voltage:4.75V~5.25V Supply Voltage:4.75V~5.25V Supply Current:50mA; LCSC Part Name: 4.75V~5.25V; Supplier Part: C6952; Manufacturer: NXP(恩智浦); Supplier Footprint: SOP-8; JLCPCB Part Class: Extended Part; Datasheet: https://www.nxp.com/docs/en/data-sheet/TJA1050.pdf; Supplier: LCSC; Supply Voltage: 4.75V~5.25V; Supply Current: 50mA
U12 = ZX-DC-WC2.56.3: Connector Type:DC Power Jack Mounting Type:Right Angle Inside Contact Diameter:2.5mm Outside Contact Diameter:6.3mm Current Rating:3A Voltage Rating (Max):30V Operating Temperature:-20℃~+70℃ Operating Temperature:-20℃~+70℃; LCSC Part Name: DC电源插座 内径:2.5mm 外径:6.3mm; Supplier Part: C7419923; Manufacturer: Megastar(兆星); Supplier Footprint: 插件; JLCPCB Part Class: Extended Part; Datasheet: https://item.szlcsc.com/datasheet/ZX-DC-WC2.56.3/8394945.html; Supplier: LCSC; Connector Type: DC Power Jack; Mounting Type: Right Angle; Inside Contact Diameter: 2.5mm; Outside Contact Diameter: 6.3mm; Current Rating: 3A; Voltage Rating (Max): 30V; Operating Temperature: -20℃~+70℃
C30 = 100nF: Supplier: LCSC; Manufacturer: YAGEO(国巨); Manufacturer Part: CC0603KRX7R9BB104; Supplier Part: C14663; JLCPCB Part Class: Basic Part; nameAlias: Value; spicePre: C; spiceSymbolName: CC0603KRX7R9BB104
C31 C34 = 10nF: Supplier: LCSC; Manufacturer: FH(风华); Manufacturer Part: 0603B103K500NT; Supplier Part: C57112; JLCPCB Part Class: Basic Part; nameAlias: Value; spicePre: C; spiceSymbolName: 0603B103K500NT
C37-C40 = CL21A475KAQNNNE: Capacitance:4.7uF Tolerance:±10% Tolerance:±10% Voltage Rating:25V Temperature Coefficient:X5R; LCSC Part Name: 4.7uF ±10% 25V; Supplier Part: C1779; Manufacturer: SAMSUNG(三星); Supplier Footprint: 0805; JLCPCB Part Class: Basic Part; Datasheet: https://item.szlcsc.com/datasheet/CL21A475KAQNNNE/2131.html; Supplier: LCSC; Tolerance: ±10%; Voltage Rating: 25V; Temperature Coefficient: X5R
C41 = 0603B472K500NT: Capacitance:4.7nF Tolerance:±10% Tolerance:±10% Voltage Rating:50V Temperature Coefficient:X7R; LCSC Part Name: 4.7nF ±10% 50V; Supplier Part: C53987; Manufacturer: FH(风华); Supplier Footprint: 0603; JLCPCB Part Class: Basic Part; Datasheet: https://item.szlcsc.com/datasheet/0603B472K500NT/55004.html; Supplier: LCSC; Tolerance: ±10%; Voltage Rating: 50V; Temperature Coefficient: X7R
C42 = 0402CG330J500NT: Capacitance:33pF Tolerance:±5% Tolerance:±5% Voltage Rating:50V Temperature Coefficient:C0G; LCSC Part Name: 33pF ±5% 50V; Supplier Part: C1562; Manufacturer: FH(风华); Supplier Footprint: 0402; JLCPCB Part Class: Basic Part; Datasheet: https://item.szlcsc.com/datasheet/0402CG330J500NT/1914.html; Supplier: LCSC; Tolerance: ±5%; Voltage Rating: 50V; Temperature Coefficient: C0G
L6 = 10uH: Supplier: LCSC; Manufacturer: Sunlord(顺络); Manufacturer Part: SDFL1608S100KTF; Supplier Part: C1035; JLCPCB Part Class: Basic Part; nameAlias: Value; spicePre: L; spiceSymbolName: SDFL1608S100KTF
R18 = 0603WAF1801T5E: Type:Thick Film Resistor Resistance:1.8kΩ Tolerance:±1% Tolerance:±1% Power(Watts):100mW Voltage-Supply(Max):75V Temperature Coefficient:±100ppm/℃ Temperature Coefficient:±100ppm/℃ Operating Temperature:-55℃~+155℃ Operating Temperature:-55℃~+155℃; LCSC Part Name: 1.8kΩ ±1% 100mW 厚膜电阻; Supplier Part: C4177; Manufacturer: UNI-ROYAL(厚声); Supplier Footprint: 0603; JLCPCB Part Class: Basic Part; Datasheet: https://item.szlcsc.com/datasheet/0603WAF1801T5E/4584.html; Supplier: LCSC; Type: Thick Film Resistor; Tolerance: ±1%; Power(Watts): 100mW; Voltage-Supply(Max): 75V; Temperature Coefficient: ±100ppm/℃; Operating Temperature: -55℃~+155℃
R20 = 0603WAF499JT5E_C23185: Type:Thick Film Resistor Resistance:49.9Ω Tolerance:±1% Tolerance:±1% Power(Watts):100mW Voltage-Supply(Max):75V Temperature Coefficient:±100ppm/℃ Temperature Coefficient:±100ppm/℃ Operating Temperature:-55℃~+155℃ Operating Temperature:-55℃~+155℃; LCSC Part Name: 49.9Ω ±1% 100mW 厚膜电阻; Supplier Part: C23185; Manufacturer: UNI-ROYAL(厚声); Manufacturer Part: 0603WAF499JT5E; Supplier Footprint: 0603; JLCPCB Part Class: Basic Part; Datasheet: https://item.szlcsc.com/datasheet/0603WAF499JT5E/23912.html; Supplier: LCSC; Type: Thick Film Resistor; Tolerance: ±1%; Power(Watts): 100mW; Voltage-Supply(Max): 75V; Temperature Coefficient: ±100ppm/℃; Operating Temperature: -55℃~+155℃
U11 = TPS54331DR: Supplier: LCSC; Manufacturer: TI(德州仪器); Supplier Part: C9865; JLCPCB Part Class: Extended Part; spicePre: U

## Nets
3V3: C2.2 C3.2 C4.2 C5.2 C6.2 C7.2 C8.2 C9.2 C10.2 C15.2 C16.2 CN5.1 L3.1 R7.2 R8.2 U2.20(VDD3P3_RTC) U2.46(VDD3P3_CPU) U2.55(VDDA) U2.56(VDDA) U3.7(VCC) U3.10(V3) U4.19(V5) U4.20(VDD33) U13.2(VOUT) U13.4(VOUT)
12V: C34.2 C37.2 C38.2 C39.2 C40.2 C46.1 C47.1 C48.2 C49.2 RJ1.3 RJ1.4 RJ1.5 RJ1.11 RJ1.12 RJ1.13 U9.4(VM) U11.2(VIN) U12.1
+5V: C17.2 C18.2 C43.1 C44.1 CN3.1 CN4.1 D3.1(K) L6.2 LED1.1(VDD) LED2.1(VDD) R16.2 R23.1 R26.1 R32.1 R35.1 U10.3(VCC) U13.3(VIN)
GND: BOOT.1 C2.1 C3.1 C4.1 C5.1 C6.1 C7.1 C8.1 C9.1 C10.1 C11.1 C12.2 C13.1 C14.1 C15.1 C16.1 C17.1 C18.1 C31.1 C34.1 C37.1 C38.1 C39.1 C40.1 C42.1 C43.2 C44.2 C46.2 C47.2 C48.1 C49.1 CN3.2 CN4.2 CN5.2 D2.2(A) EN.1 L1.2 L2.2 LED1.4(GND) LED2.4(GND) R9.1 R10.1 R19.1 R20.1 R22.2 R25.2 R31.2 R34.2 R38.1 RJ1.6 RJ1.7 RJ1.8 RJ1.14 RJ1.15 RJ1.16 RJ1.17 RJ1.18 RJ1.19 U2.57(GND) U3.3(GND) U3.11(EP) U4.0(GND) U6.1 U6.A1 U6.A12 U9.3(GND) U10.2(GND) U10.8(RS) U11.7(GND) U12.3 U13.1(GND) X1.2(GND) X1.4(GND) X2.2(GND) X2.4(GND)
VDD_SPI: C11.2 U2.29(VDD_SPI)
340_RX: R3.2 U3.9(RXD)
340_TX: U2.50(U0RXD) U3.8(TXD)
CANH: R40.2 RJ1.2 RJ1.10 U10.7(CANH)
CANL: R40.1 RJ1.1 RJ1.9 U10.6(CANL)
CHIP_PU: C13.2 EN.2 Q2.3(C) R7.1 U2.4(CHIP_PU)
D3+: U3.1(UD+) U4.8(DP3)
D3-: U3.2(UD-) U4.7(DM3)
D4+: R1.2 U2.26(GPIO20) U4.6(DP4)
D4-: R2.2 U2.25(GPIO19) U4.5(DM4)
DTR: Q1.2(E) R5.1 U3.4(DTR#)
GPIO0: BOOT.2 Q1.3(C) R8.1 U2.5(GPIO0)
GPIO1: U2.6(GPIO1)
GPIO2: U2.7(GPIO2)
GPIO3: U2.8(GPIO3)
GPIO4: U2.9(GPIO4)
GPIO5: U2.10(GPIO5)
GPIO6: U2.11(GPIO6) U9.1(INA)
GPIO7: U2.12(GPIO7) U9.2(INB)
GPIO8: U2.13(GPIO8)
GPIO9: R28.2 U2.14(GPIO9)
GPIO10: R29.2 U2.15(GPIO10)
GPIO11: R36.2 U2.16(GPIO11)
GPIO12: R37.2 U2.17(GPIO12)
GPIO13: CN5.3 U2.18(GPIO13)
GPIO14: CN5.4 U2.19(GPIO14)
GPIO15: U2.21(XTAL_32K_P)
GPIO16: U2.22(XTAL_32K_N)
GPIO17: U2.23(GPIO17) U10.1(D)
GPIO18: R38.2 R39.1 U2.24(GPIO18)
GPIO21: U2.27(GPIO21)
GPIO38: U2.43(GPIO38)
GPIO39: LED1.2(DI) U2.44(MTCK)
GPIO40: U2.45(MTDO)
GPIO41: U2.47(MTDI)
GPIO42: U2.48(MTMS)
GPIO45: U2.51(GPIO45)
GPIO46: U2.52(GPIO46)
GPIO47: U2.37(SPICLK_P)
GPIO48: U2.36(SPICLK_N)
LED_1: LED1.3(DO) LED2.2(DI)
LED_2: LED2.3(DO)
M_OUTA: C45.2 P1.1 U9.7(OUTA) U9.8(OUTA)
M_OUTB: C45.1 P1.2 U9.5(OUTB) U9.6(OUTB)
RTS: Q2.2(E) R4.1 U3.6(RTS#)
U0TX: R3.1 U2.49(U0TXD)
USB_5V: D3.2(A) U6.A4 U6.A9
USB_D+: R1.1 TP1.1 U4.15(DPU) U6.A6 U6.B6
USB_D-: R2.1 TP2.1 U4.14(DMU) U6.A7 U6.B7
XIN: U4.4(XI) X1.1
XOUT: U4.3(XO) X1.3
XTAL_N: C12.1 U2.53(XTAL_N) X2.3
XTAL_P: C14.2 L4.2 X2.1
$1N4043: R9.2 U6.B5
$1N4044: R10.2 U6.A5
$1N4145: Q2.1(B) R5.2
$1N4146: Q1.1(B) R4.2
$1N15135: L3.2 U2.2(VDD3P3) U2.3(VDD3P3)
$1N27024: C1.2 L2.1 U2.1(LNA_IN)
$1N27033: C1.1 L1.1 U1.2
$1N27209: L4.1 U2.54(XTAL_P)
$2N2515: C30.1 U11.1(BOOT)
$2N2516: C30.2 D2.1(K) L6.1 U11.8(PH)
$2N2519: C31.2 U11.4(SS)
$2N2520: C41.2 C42.2 U11.6(COMP)
$2N2522: R16.1 R18.2 U11.5(VSENSE)
$2N2707: R18.1 R19.2
$2N2891: C41.1 R20.2
$3N3799: CN3.3 R21.1 R23.2
$3N3817: R21.2 R22.1 R28.1
$3N4028: CN3.4 R24.1 R26.2
$3N4031: R24.2 R25.1 R29.1
$3N4599: CN4.4 R33.1 R35.2
$3N4605: R33.2 R34.1 R37.1
$3N4615: R30.2 R31.1 R36.1
$3N4618: CN4.3 R30.1 R32.2
$3N6168: R39.2 U10.4(R)

Not connected (* = marked no-connect by the designer): U1 1*; U2 28(SPICS1) 30(SPIHD) 31(SPIWP) 32(SPICS0) 33(SPICLK) 34(SPIQ) 35(SPID) 38(GPIO33) 39(GPIO34) 40(GPIO35) 41(GPIO36) 42(GPIO37); U3 5(CTS#)*; U4 1(OVCUR#)* 2(NC.)* 9(DM2)* 10(DP2)* 11(DM1)* 12(DP1)* 13(LED3/SCL)* 16(RESET#/CDP)* 17(NC.)* 18(PSELF)* 21(LED4/SDA)* 22(LED1)* 23(LED2)* 24(PWREN#)*; U6 A8* B8*; U10 5(VREF); U11 3(EN); U12 2

## Notes on the sheets
sheet 1
- HUB Over Ride
- ESP32-S3
- UART
- USB HUB
- 主控时钟
- 按键
- 排针
- TYPE-C
- power supply
